# Altium schematic sheet cpu_rev2.SchDoc
size A4
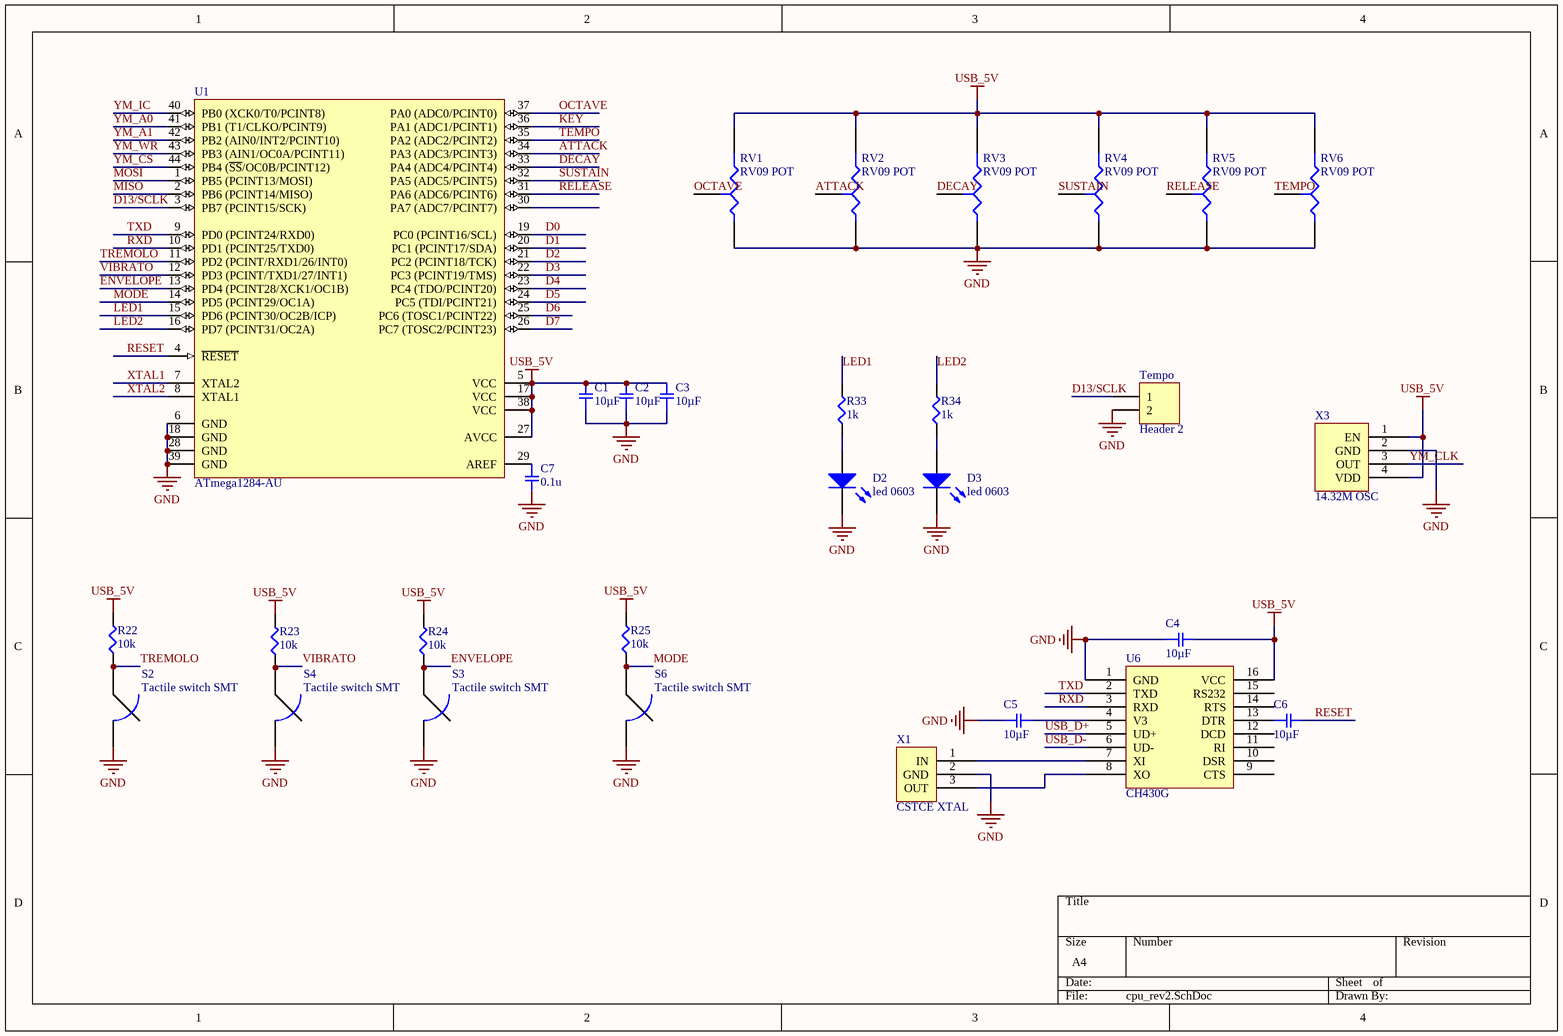
[diagram p0: cpu_rev2.SchDoc]

## Parts
C1  10µF  [SMD-0805C]
C2  10µF  [SMD-0805C]
C3  10µF  [SMD-0805C]
C4  10µF  [SMD-0805C]
C5  10µF  [SMD-0805C]
C6  10µF  [SMD-0805C]
C7  0.1u  [SMD-0805C]
D2  led 0603  [led 0603]
D3  led 0603  [led 0603]
R22  10k  [SMD-0603-RES]
R23  10k  [SMD-0603-RES]
R24  10k  [SMD-0603-RES]
R25  10k  [SMD-0603-RES]
R33  1k  [SMD-0805-RES]
R34  1k  [SMD-0805-RES]
RV1  RV09 POT  [RV09]
RV2  RV09 POT  [RV09]
RV3  RV09 POT  [RV09]
RV4  RV09 POT  [RV09]
RV5  RV09 POT  [RV09]
RV6  RV09 POT  [RV09]
S2  Tactile switch SMT  [Tactile switch SMT]
S3  Tactile switch SMT  [Tactile switch SMT]
S4  Tactile switch SMT  [Tactile switch SMT]
S6  Tactile switch SMT  [Tactile switch SMT]
Tempo  Header 2  [HDR1X2]
U1  ATmega1284-AU  [44A_N]
U6  CH430G  [CH430G]
X1  CSTCE XTAL  [CSTCE-CCM-R0]
X3  14.32M OSC  [OSC]

## Nets
GND: C1.1 C2.1 C3.1 C4.1 C5.1 C7.2 D2.2 D3.2 RV1.1(A) RV2.1(A) RV3.1(A) RV4.1(A) RV5.1(A) RV6.1(A) S2.2 S3.2 S4.2 S6.2 Tempo.2 U1.6(GND) U1.18(GND) U1.28(GND) U1.39(GND) U6.1(GND) X1.2(GND) X3.2(GND)
USB_5V: C1.2 C2.2 C3.2 C4.2 R22.2 R23.2 R24.2 R25.2 RV1.3(B) RV2.3(B) RV3.3(B) RV4.3(B) RV5.3(B) RV6.3(B) U1.5(VCC) U1.17(VCC) U1.27(AVCC) U1.38(VCC) U6.16(VCC) X3.1(EN) X3.4(VDD)
ATTACK: RV2.2(TAP) U1.34(PA3_(ADC3/PCINT3))
D0: U1.19(PC0_(PCINT16/SCL))
D1: U1.20(PC1_(PCINT17/SDA))
D2: U1.21(PC2_(PCINT18/TCK))
D3: U1.22(PC3_(PCINT19/TMS))
D4: U1.23(PC4_(TDO/PCINT20))
D5: U1.24(PC5_(TDI/PCINT21))
D6: U1.25(PC6_(TOSC1/PCINT22))
D7: U1.26(PC7_(TOSC2/PCINT23))
D13/SCLK: Tempo.1 U1.3(PB7_(PCINT15/SCK))
DECAY: RV3.2(TAP) U1.33(PA4_(ADC4/PCINT4))
ENVELOPE: R24.1 S3.1 U1.13(PD4_(PCINT28/XCK1/OC1B))
KEY: U1.36(PA1_(ADC1/PCINT1))
LED1: R33.2 U1.15(PD6_(PCINT30/OC2B/ICP))
LED2: R34.2 U1.16(PD7_(PCINT31/OC2A))
MISO: U1.2(PB6_(PCINT14/MISO))
MODE: R25.1 S6.1 U1.14(PD5_(PCINT29/OC1A))
MOSI: U1.1(PB5_(PCINT13/MOSI))
OCTAVE: RV1.2(TAP) U1.37(PA0_(ADC0/PCINT0))
RELEASE: RV5.2(TAP) U1.31(PA6_(ADC6/PCINT6))
RESET: C6.2 U1.4(~{RESET})
RXD: U1.10(PD1_(PCINT25/TXD0)) U6.3(RXD)
SUSTAIN: RV4.2(TAP) U1.32(PA5_(ADC5/PCINT5))
TEMPO: RV6.2(TAP) U1.35(PA2_(ADC2/PCINT2))
TREMOLO: R22.1 S2.1 U1.11(PD2_(PCINT/RXD1/26/INT0))
TXD: U1.9(PD0_(PCINT24/RXD0)) U6.2(TXD)
USB_D+: U6.5(UD+)
USB_D-: U6.6(UD-)
VIBRATO: R23.1 S4.1 U1.12(PD3_(PCINT/TXD1/27/INT1))
XTAL1: U1.7(XTAL2)
XTAL2: U1.8(XTAL1)
YM_A0: U1.41(PB1_(T1/CLKO/PCINT9))
YM_A1: U1.42(PB2_(AIN0/INT2/PCINT10))
YM_CLK: X3.3(OUT)
YM_CS: U1.44(PB4_(~{SS}/OC0B/PCINT12))
YM_IC: U1.40(PB0_(XCK0/T0/PCINT8))
YM_WR: U1.43(PB3_(AIN1/OC0A/PCINT11))
NetC5_2: C5.2 U6.4(V3)
NetC6_1: C6.1 U6.13(DTR)
NetC7_1: C7.1 U1.29(AREF)
NetD2_1: D2.1 R33.1
NetD3_1: D3.1 R34.1
NetU6_7: U6.7(XI) X1.1(IN)
NetU6_8: U6.8(XO) X1.3(OUT)

Not connected (* = marked no-connect by the designer): U1 30(PA7_(ADC7/PCINT7)); U6 9(CTS) 10(DSR) 11(RI) 12(DCD) 14(RTS) 15(RS232)

## Library data of the parts
C1-C6 = GRM219R60J106KE19D: CAP CER 10UF 6.3V X5R 0805; Manufacturer: Murata Electronics North America; Factory Stock: 0; Unit Price (USD): 0.13; Minimum Quantity: 1; Tolerance: ±10%; Datasheets: http://www.murata.com/~/media/webrenewal/support/library/catalog/products/capacitor/mlcc/c02e.pdf; Image: //media.digikey.com/Renders/Murata%20Renders/0805%20(2012%20Metric)%20.85mm.jpg; Digi-Key Part Number: 490-3340-1-ND; Part Number: GRM219R60J106KE19D; Quantity Available: 448313; @ qty: 0; Packaging: Cut Tape (CT); Series: GRM; Part Status: Active; Value: 10µF; Voltage: 6.3V; Temperature Coefficient: X5R; Operating Temperature: -55°C ~ 85°C; Features: -; Ratings: -; Applications: General Purpose; Mounting Type: Surface Mount, MLCC; Package / Case: 0805 (2012 Metric); Size / Dimension: 0.079" L x 0.049" W (2.00mm x 1.25mm); Height - Seated (Max): -; Thickness (Max): 0.037" (0.95mm); Lead Spacing: -; Lead Style: -
C7 = GRM216R71E103KA01D: CAP CER 10000PF 25V X7R 0805; Manufacturer: Murata Electronics North America; Factory Stock: 0; Unit Price (USD): 0.1; Minimum Quantity: 1; Tolerance: ±10%; Datasheets: http://www.murata.com/~/media/webrenewal/support/library/catalog/products/capacitor/mlcc/c02e.pdf; Image: //media.digikey.com/Renders/Murata%20Renders/0805%20(2012%20Metric)%20.85mm.jpg; Digi-Key Part Number: 490-12748-1-ND; Part Number: GRM216R71E103KA01D; Quantity Available: 9736; @ qty: 0; Packaging: Cut Tape (CT); Series: GRM; Part Status: Active; Value: 10000pF; Voltage: 25V; Temperature Coefficient: X7R; Operating Temperature: -55°C ~ 125°C; Features: -; Ratings: -; Applications: General Purpose; Mounting Type: Surface Mount, MLCC; Package / Case: 0805 (2012 Metric); Size / Dimension: 0.079" L x 0.049" W (2.00mm x 1.25mm); Height - Seated (Max): -; Thickness (Max): 0.028" (0.70mm); Lead Spacing: -; Lead Style: -
R22-R25 = ERJ-3EKF1002V: RES SMD 10K OHM 1% 1/10W 0603; Manufacturer: Panasonic Electronic Components; Factory Stock: 0; Unit Price (USD): 0.00379; @ qty: 1500; Minimum Quantity: 1; Power (Watts): 0.1W, 1/10W; Temperature Coefficient: ±100ppm/°C; Part Number: ERJ-3EKF1002V; Datasheets: http://industrial.panasonic.com/www-cgi/jvcr13pz.cgi?E+PZ+3+AOA0002+ERJ3EKF1002V+7+WW; Image: //media.digikey.com/Photos/Panasonic%20Photos/MFG_ERJ-P6W%20Series.jpg; Digi-Key Part Number: P10.0KHCT-ND; Quantity Available: 6703141; Packaging: Cut Tape (CT); Series: ERJ; Part Status: Active; Value: 10k; Tolerance: ±1%; Composition: Thick Film; Features: Automotive AEC-Q200; Operating Temperature: -55°C ~ 155°C; Package / Case: 0603 (1608 Metric); Supplier Device Package: 0603; Size / Dimension: 0.063" L x 0.031" W (1.60mm x 0.80mm); Height - Seated (Max): 0.022" (0.55mm); Number of Terminations: 2; Failure Rate: -
R33 R34 = ERJ-P06F1001V: RES SMD 1K OHM 1% 1/2W 0805; Manufacturer: Panasonic Electronic Components; Factory Stock: 0; Unit Price (USD): 0.02534; @ qty: 1500; Minimum Quantity: 1; Power (Watts): 0.5W, 1/2W; Temperature Coefficient: ±100ppm/°C; Part Number: ERJ-P06F1001V; Datasheets: https://industrial.panasonic.com/cdbs/www-data/pdf/RDA0000/AOA0000C243.pdf; Image: //media.digikey.com/Renders/Panasonic%20Renders/ERJ-0805%20Pkg.jpg; Digi-Key Part Number: P16058CT-ND; Quantity Available: 161264; Packaging: Cut Tape (CT); Series: ERJ; Part Status: Active; Value: 1k; Tolerance: ±1%; Composition: Thick Film; Features: Automotive AEC-Q200, Pulse Withstanding; Operating Temperature: -55°C ~ 155°C; Package / Case: 0805 (2012 Metric); Supplier Device Package: 0805; Size / Dimension: 0.079" L x 0.049" W (2.00mm x 1.25mm); Height - Seated (Max): 0.028" (0.70mm); Number of Terminations: 2; Failure Rate: -
Tempo = Header 2: Header, 2-Pin; LatestRevisionDate: 17-Jul-2002; LatestRevisionNote: Re-released for DXP Platform.; Publisher: Altium Limited
U1 = ATmega1284-AU: 8-bit AVR Microcontroller, 128KB Flash, 4KB EEPROM, 16KB SRAM, 44-pin TQFP, Industrial Grade (-40°C to 85°C); Published: 1-Apr-2010; DatasheetVersion: revA, Jan-2010; PackageVersion: rev.B, Oct-2001; PackageReference: 44A; Publisher: Altium Limited; PackageDescription: 44-Pin Plastic Thin Profile Quad Flat Pack, 10 x 10 x 1.0 mm Body, 0.8 mm Pitch (TQFP); Supplier 1: Digi-Key; Supplier Part Number 1: ATMEGA1284-AU-ND; Supplier 2: Mouser; Supplier Part Number 2: 556-ATMEGA1284-AU; ComponentLink1Description: Manufacturer Link; ComponentLink1URL: http://www.atmel.com/products/avr/default.asp?; ComponentLink2Description: ATmega164A/164PA/324A/324PA/644A/644PA/1284/1284P Datasheet; ComponentLink2URL: http://www.atmel.com/dyn/resources/prod_documents/doc8272.pdf; ComponentLink3Description: ATmega164A/164PA/324A/324PA/644A/644PA/1284/1284P Summary; ComponentLink3URL: http://www.atmel.com/dyn/resources/prod_documents/8272S.pdf; ComponentLink4Description: Atmel.com Home; ComponentLink4URL: http://www.atmel.com
X1 = CSTCE XTAL: CST XTAL